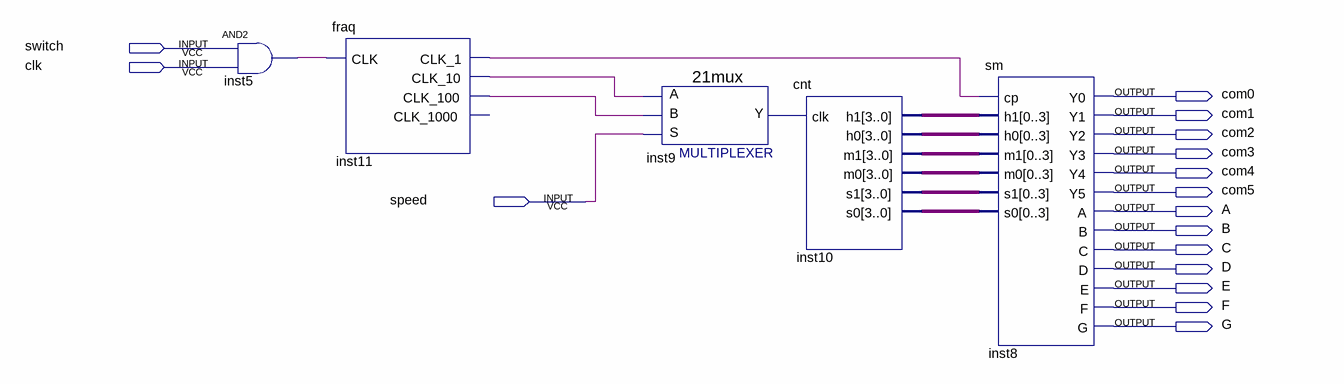
[diagram p0: schematic sheet]
// Quartus schematic clock1.bdf as structural Verilog: 5 symbols, 16 pins
module clock1 (
  input  switch,
  input  clk,
  input  speed,
  output com0,
  output com1,
  output com2,
  output com3,
  output com4,
  output com5,
  output A,
  output B,
  output C,
  output D,
  output E,
  output F,
  output G
);

  wire inst5_out, inst9_y, inst11_clk_1, inst11_clk_10, inst11_clk_100;
  wire [3:0] inst10_h0, inst10_h1, inst10_m0, inst10_m1, inst10_s0, inst10_s1;

  and inst5 (inst5_out, switch, clk);
  fraq inst11 (
    .CLK(inst5_out), .CLK_1(inst11_clk_1), .CLK_10(inst11_clk_10), .CLK_100(inst11_clk_100));  // open: CLK_1000
  \21mux  inst9 (.S(speed), .B(inst11_clk_100), .A(inst11_clk_10), .Y(inst9_y));
  cnt inst10 (
    .clk(inst9_y), .h1(inst10_h1), .h0(inst10_h0), .m1(inst10_m1), .m0(inst10_m0), .s1(inst10_s1),
    .s0(inst10_s0));
  sm inst8 (
    .cp(inst11_clk_1), .h1(inst10_h1), .h0(inst10_h0), .m1(inst10_m1), .m0(inst10_m0), .s1(inst10_s1),
    .s0(inst10_s0), .Y0(com0), .Y1(com1), .Y2(com2), .Y3(com3), .Y4(com4), .Y5(com5), .A(A), .B(B), .C(C),
    .D(D), .E(E), .F(F), .G(G));
endmodule
